# Altium schematic sheet MICRO CONTROLLER.SchDoc: MICRO CONTROLLER
size A3; Author: DODANHLUONG; Revision: 1.0; SheetNumber: 4; SheetTotal: 6; ProjectTitle: ESP32_C3_VERSION_1
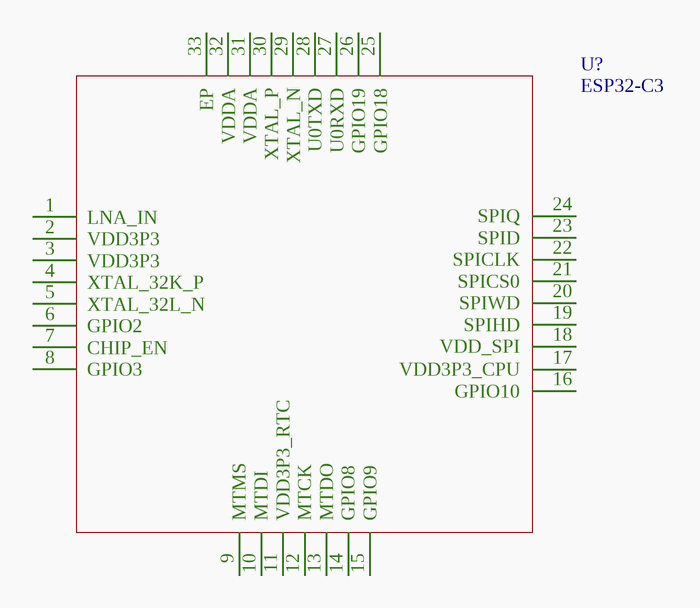
[diagram p0: MICRO CONTROLLER.SchDoc]

## Parts
U?  ESP32-C3  [ESP32-C3]

## Nets

Not connected (* = marked no-connect by the designer): U? 1(LNA_IN) 2(VDD3P3) 3(VDD3P3) 4(XTAL_32K_P) 5(XTAL_32L_N) 6(GPIO2) 7(CHIP_EN) 8(GPIO3) 9(MTMS) 10(MTDI) 11(VDD3P3_RTC) 12(MTCK) 13(MTDO) 14(GPIO8) 15(GPIO9) 16(GPIO10) 17(VDD3P3_CPU) 18(VDD_SPI) 19(SPIHD) 20(SPIWD) 21(SPICS0) 22(SPICLK) 23(SPID) 24(SPIQ) 25(GPIO18) 26(GPIO19) 27(U0RXD) 28(U0TXD) 29(XTAL_N) 30(XTAL_P) 31(VDDA) 32(VDDA) 33(EP)

## Notes on the sheet
- Author:
- Title:
- Size:
- A3
- Project:
- Revision:
- Modified Date:
- CheckedBy:
- Date:
- SW Version:

## Library data of the parts
U? = ESP32-C3: Ultra-Low-Power SoC with RISC-V Single-Core CPU, 2.4 GHz Wi-Fi and Bluetooth 5 (LE); Manufacturer: ESPRESSIF; Key Attributes: RISC-V 160MHz QFN-32-EP(5x5) Microcontrollers (MCU/MPU/SOC) ROHS; Mfr. Part #: ESP32-C3; LCSC Part #: C2838500; Package: QFN-32-EP(5x5); Link: https://www.lcsc.com/product-detail/C2838500.html?s_z=n_esp32-c3